# Altium schematic sheet Project_Schematic.SchDoc
size A4; SheetNumber: 4; SheetTotal: 4
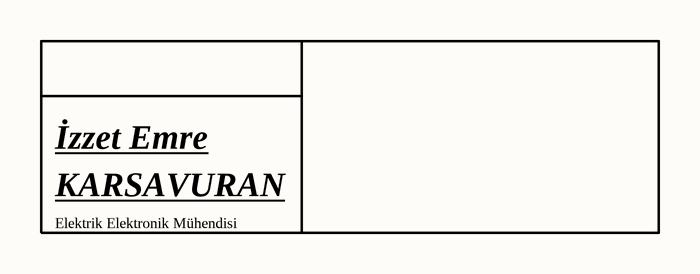
[diagram p0: Project_Schematic.SchDoc]

## Notes on the sheet
- İzzet Emre <https://www.linkedin.com/in/izzet-emre-karsavuran-24704417b>
- KARSAVURAN <https://github.com/iek21?>
- Elektrik Elektronik Mühendisi